# Altium schematic sheet HBridge.SchDoc
size 420 x 297 mm; DocumentNumber: 3; SheetNumber: 12; SheetTotal: 14; PageSetup: Record=PageOptions|CenterHorizontal=True|CenterVertical=True|PrintScale=0.96|XCorrection=1.00|YCorrection=1.00|PrintKind=1|BorderSize=5000000|LeftOffset=0|BottomOffset=0|Orientation=2|PaperLength=4318|PaperWidth=2794|Scale=100|PaperSource=7|PrintQuality=600|MediaType=1|DitherType=10|PaperKind=11" x 17"|PrintScaleMode=1
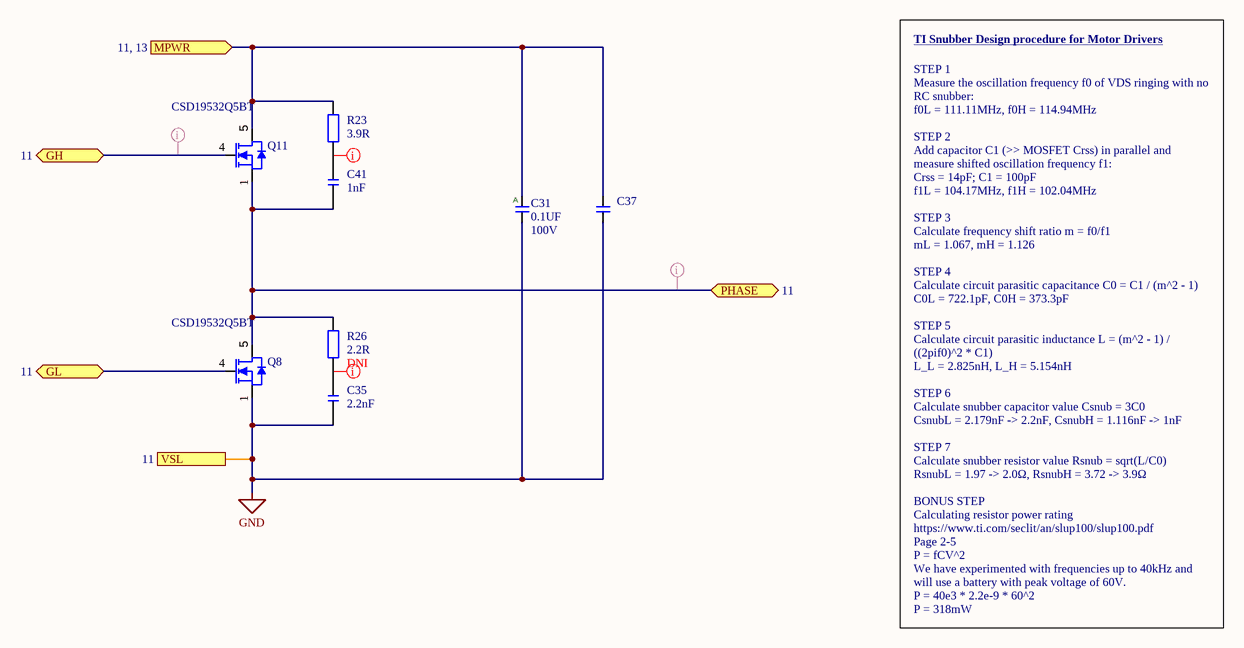
[diagram p0: HBridge.SchDoc]

## Parts
C31  value 0.1UF  Voltage: 100V  [C0603]  (hidden comment: __Template_Cap_Auto)
C35  2.2nF  [C0603]
C37  4.7UF  [C1210]  (value not drawn)
C41  1nF  [C0603]
NT3  Mechanical Feature NET_TIE_10MIL  [NETTIE_10MIL]  (value not drawn)  (net tie, no BOM)
Q8  value CSD19532Q5BT  [TI_SON5X6]  (hidden comment: TI CSD19532Q5B)
Q11  value CSD19532Q5BT  [TI_SON5X6]  (hidden comment: TI CSD19532Q5B)
R23  3.9R  [R0805]
R26  2.2R  [R0805]

## Ports
GH (bidir, see 11), GL (bidir, see 11), MPWR (in, see 11, 13), PHASE (bidir, see 11), VSL (out, see 11)

## Nets
GND: C31.2 C35.1 C37.2 NT3.2 Q8.1(S)
GH: Q11.4(G) ; port GH
GL: Q8.4(G) ; port GL
MPWR: C31.1 C37.1 Q11.5(D) R23.2 ; port MPWR
PHASE: C41.1 Q8.5(D) Q11.1(S) R26.2 ; port PHASE
VSL: NT3.1 ; port VSL
NetC35_2: C35.2 R26.1
NetC41_2: C41.2 R23.1

## Layout directives
net class HVSW: GH, PHASE
net class HV: NetC35_2, NetC41_2

## Notes on the sheet
- TI Snubber Design procedure for Motor Drivers <https://e2e.ti.com/support/motor-drivers-group/motor-drivers/f/motor-drivers-forum/991693/faq-proper-rc-snubber-design-for-motor-drivers>
- STEP 1
  Measure the oscillation frequency f0 of VDS ringing with no RC snubber:
  f0L = 111.11MHz, f0H = 114.94MHz
  STEP 2
  Add capacitor C1 (>> MOSFET Crss) in parallel and measure shifted oscillation frequency f1:
  Crss = 14pF; C1 = 100pF
  f1L = 104.17MHz, f1H = 102.04MHz
  STEP 3
  Calculate frequency shift ratio m = f0/f1
  mL = 1.067, mH = 1.126
  STEP 4
  Calculate circuit parasitic capacitance C0 = C1 / (m^2 - 1)
  C0L = 722.1pF, C0H = 373.3pF
  STEP 5
  Calculate circuit parasitic inductance L = (m^2 - 1) / ((2pif0)^2 * C1)
  L_L = 2.825nH, L_H = 5.154nH
  STEP 6
  Calculate snubber capacitor value Csnub = 3C0
  CsnubL = 2.179nF -> 2.2nF, CsnubH = 1.116nF -> 1nF
  STEP 7
  Calculate snubber resistor value Rsnub = sqrt(L/C0)
  RsnubL = 1.97 -> 2.0Ω, RsnubH = 3.72 -> 3.9Ω
  BONUS STEP
  Calculating resistor power rating
  https://www.ti.com/seclit/an/slup100/slup100.pdf
  Page 2-5
  P = fCV^2
  We have experimented with frequencies up to 40kHz and will use a battery with peak voltage of 60V.
  P = 40e3 * 2.2e-9 * 60^2
  P = 318mW
- CREATIVE COMMONS
- PUBLIC LICENSE:
- BARKOUR ROBOT
- CC BY-NC 4.0
- APPROVED
- DWG NO
- GOOGLE LLC
- FILE
- RELEASED
- 2024/05/09
- SIZE
- 1600 AMPHITHEATRE PARKWAY
- MOUNTAIN VIEW CA 94043
- A3
- SHEET
- OF
- THIS DESIGN IS BEING PROVIDED  FOR NON-COMMERCIAL USE ONLY. THE USE OF =SCIENTIST_NAME_POSSESSIVE NAME IN CONNECTION WITH THE DESIGN IS NOT INTENDED TO IMPLY THAT =SCIENTIST_NAME SPONSORS OR ENDORSES THE DESIGN, GOOGLE LLC, OR ANY OF GOOGLE LLC'S PRODUCTS OR SERVICES.
- (in symbol 1039) A

## Library data of the parts
C31 = 1039: CAP, CER, X7S, 0.1uF, 100V, 10%, 0603, AUTOGRADE; MFG: TDK; MFG P/N: CGA3E3X7S2A104K080AB; COMMON: 150-00222-00; Status: Released; Package: 0603; Supplier 1: Digi-Key; ComponentLink1URL: https://www.digikey.com/en/products/detail/tdk-corporation/CGA3E3X7S2A104K080AB/2672831; Supplier Part Number 1: 445-6938-1-ND
C35 = C: Multilayer Ceramic Capacitors MLCC - SMD/SMT 0603 2.2nF 100volts X7R 10%; MFG: Vishay / Vitramon; MFG P/N: VJ0603Y222KXBAC31X; Voltage: 100V; ComponentLink1URL: https://www.mouser.com/datasheet/2/427/vj31xrohsautomlcc-1763818.pdf; Supplier 1: Mouser; Supplier Part Number 1: 77-V0603Y222KXBAC31X; Value: 2.2nF
C37 = CAP_CER_1210_4.7UF_100V_20%_X7S: CAP CER 4.7UF 100V X7S 1210; MFG: Taiyo Yuden; MFG P/N: HMK325C7475MM-PE; Supplier 1: Digi-Key; Supplier Part Number 1: 587-5040-1-ND; ComponentLink1URL: https://www.digikey.com/en/products/detail/taiyo-yuden/HMK325C7475MM-PE/6563633; Value: 4.7UF; Voltage: 100V; Package: 1210
C41 = C: Multilayer Ceramic Capacitors MLCC - SMD/SMT 0603 1.0nF 100volts X7R 10%; MFG: Vishay / Vitramon; MFG P/N: VJ0603Y102KXBAC31X; Voltage: 100V; ComponentLink1URL: https://www.mouser.com/datasheet/2/427/vj31xrohsautomlcc-1763818.pdf; Supplier 1: Mouser; Supplier Part Number 1: 77-V0603Y102KXBAC31X; Value: 1nF
NT3 = 5ac3c692-7d27-4cd1-ace3-d4aa111a5a9d: Net Tie, 10mil trace; Package: Net Tie, 10mil trace; Status: Preliminary
Q8 Q11 = be020311-d2d7-4d79-a360-c856c6f37d83: MOSFET N-CH 100V 100A 8SON; MFG: Texas Instruments; Package: 8-PowerTDFN SON5x6; ComponentLink1URL: https://www.digikey.com/en/products/detail/texas-instruments/CSD19532Q5BT/6110536?s=N4IgjCBcpgbFoDGUBmBDANgZwKYBoQB7KAbRACYBOAFgA4AGeAXQIAcAXKEAZXYCcAlgDsA5iAC%2BBWJQQhkkdNnxFSIavUoBmLSBYgOXXoNESCAVgDs9WfMW4CxSGU0Wr1GXoOQe-YWMkgsIw2qJj2Kk4gLrSUsbpsnN5GfqaB9LQhCmHKjmSwtGYaIFIFYNaeiT7G-gRg5Jrw0HKhSg6qYBaaZRAVhr4mAeSMGU222W2RZfQABABq8fqVAKpCAuwA8igAsjhoWACufDipALTkmfz7OapmuuL3QA; Status: Preliminary; MFG P/N: CSD19532Q5BT; Supplier 1: Digi-Key; Supplier Part Number 1: 296-44471-1-ND
R23 = R: RES SMD 3.9 OHM 5% 1/2W 0805; MFG: Panasonic Electronic Components; MFG P/N: ERJ-HP6F3R90V; ComponentLink1URL: https://www.digikey.com/en/products/detail/panasonic-electronic-components/ERJ-HP6F3R90V/13877855; Supplier 1: Digi-Key; Supplier Part Number 1: 10-ERJ-HP6F3R90VCT-ND; Value: 3.9R; Package: 0805
R26 = R: RES SMD 2.2 OHM 1% 1/2W 0805; MFG: Vishay Dale; MFG P/N: CRCW08052R20FKEAHP; ComponentLink1URL: https://www.digikey.com/en/products/detail/vishay-dale/CRCW08052R20FKEAHP/2226670; Supplier 1: Digi-Key; Supplier Part Number 1: 541-2.20TCT-ND; Value: 2.2R; DNI: DNI